# Altium schematic sheet Master.SchDoc
size 431 x 279 mm; SheetNumber: 1; SheetTotal: 6
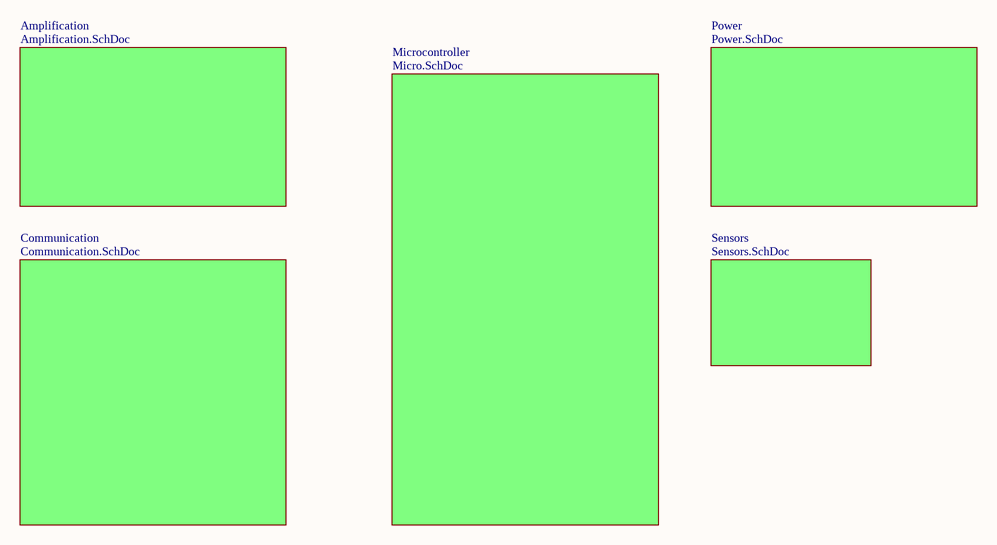
[diagram p0: Master.SchDoc]

## Sub-sheets
Amplification = Amplification.SchDoc: no entries
Communication = Communication.SchDoc: no entries
Microcontroller = Micro.SchDoc: no entries
Power = Power.SchDoc: no entries
Sensors = Sensors.SchDoc: no entries

## Notes on the sheet
- DWG. NO.
- REV.
- SHT.
- THIS DOCUMENT AND THE DATA DISCLOSED HEREIN OR HEREWITH IS THE PROPERTY OF ALTIUM LIMITED AND MAY BE FREELY DISTRIBUTED IN WHOLE. NO RIGHTS ARE RESERVED OR EXPRESS OR IMPLIED WARANTEE GIVEN.
- REVISION
- DESCRIPTION
- DATE
- APPROVED
- ENG:
- APPROVALS
- PROJECT
- DSN:
- CHK:
- REFERENCE DOCUMENTS
- PROJECT REVISION:
- TITLE
- DOCUMENT REVISION:
- DESIGN ITEM:
- BOM:
- FAB DWG:
- PCB DWG:
- ASSY DWG:
- SCALE:
- SIZE
- B
- CAGE CODE
- FILE NAME
- DWG NO.
- SHEET
- OF
- REV